# Altium project STLink_V2_Design.PrjPcb
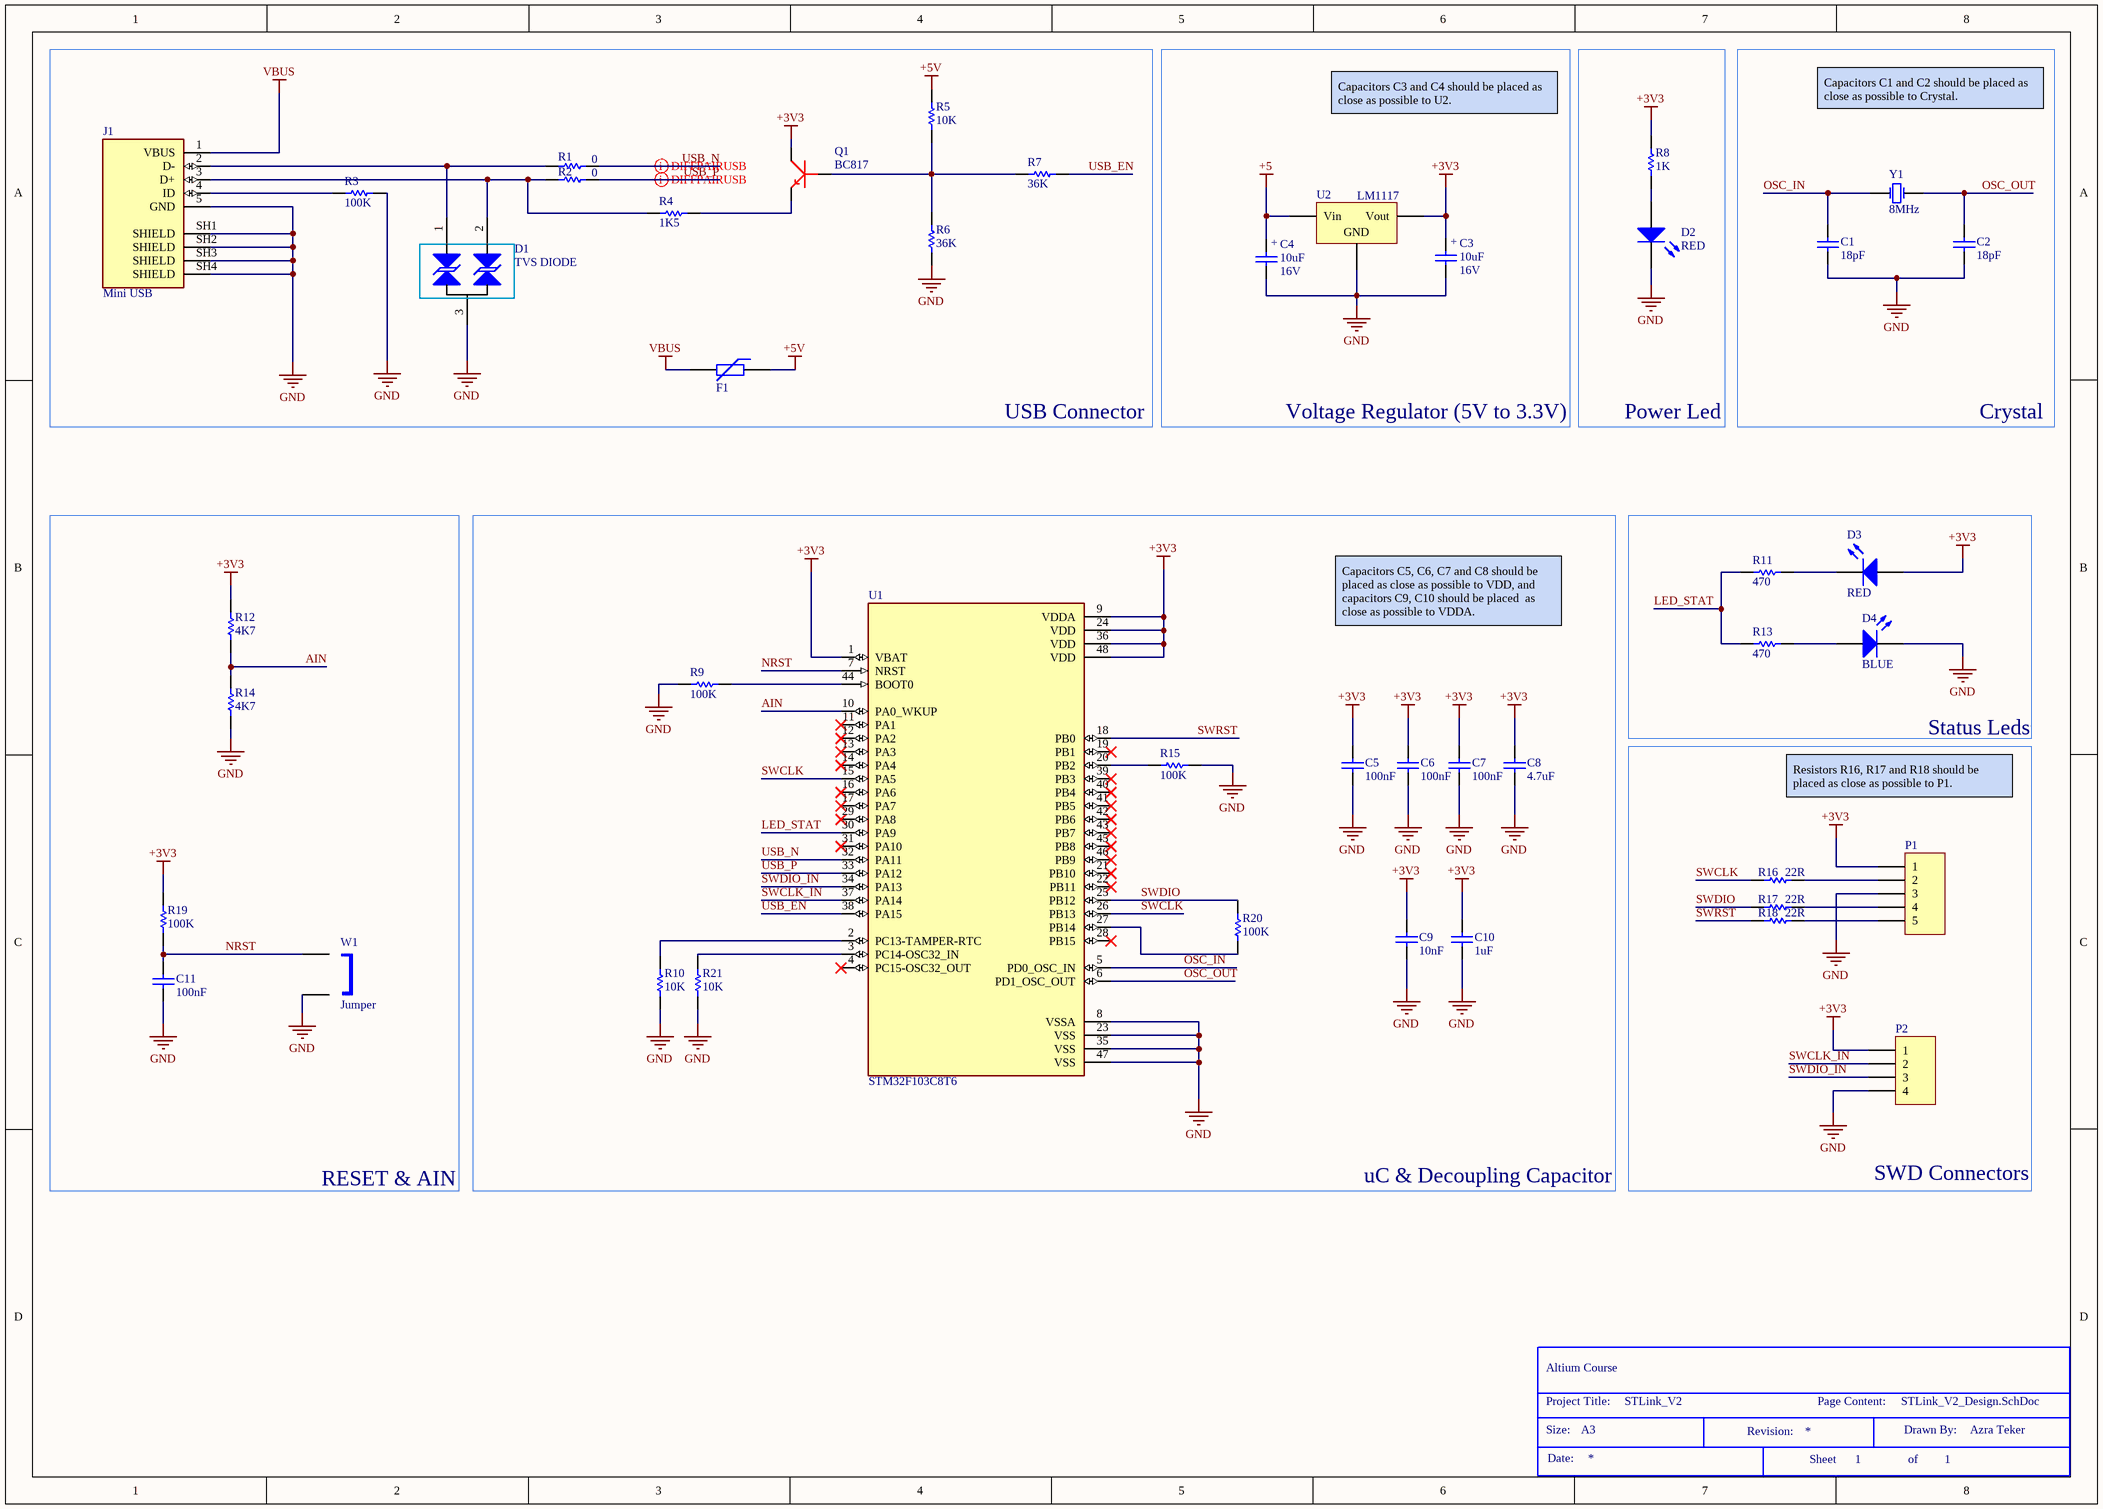
[diagram p0: STLink_V2_Design.SchDoc]
NameProject: STLink_V2
1 sheet, 46 parts. Net scope: global (net labels, ports and power ports of the same name join across sheets).
Board file: STLink_V2_Design.PcbDoc

## Sheet STLink_V2_Design.SchDoc
size A3; DocumentNumber: 1; SheetNumber: 1; SheetTotal: 1

### Parts
*?  Size: A3  Drawn By: Azra Teker  (hidden comment: Title Block)  (graphical)
C1  18pF  [C805]
C2  18pF  [C805]
C3  Volte: 16V  [MY_SMC_B]  (hidden comment: 10uF)
C4  Volte: 16V  [MY_SMC_B]  (hidden comment: 10uF)
C5  100nF  [C805]
C6  100nF  [C805]
C7  100nF  [C805]
C8  4.7uF  [C805]
C9  10nF  [C805]
C10  1uF  [C805]
C11  100nF  [C805]
D1  TVS DIODE  [SOT-23]
D2  RED  [MY_LED_1206]
D3  RED  [MY_LED_0805]
D4  BLUE  [MY_LED_0805]
F1  (no value)  [PTC-0805]
J1  Mini USB  [MiniUSB]
P1  Header 5  [My_1X05]  (value not drawn)
P2  Header 4  [My_1X04]  (value not drawn)
Q1  BC817  [SOT23_3]
R1  0  [R0603]
R2  0  [R0603]
R3  100K  [R0603]
R4  1K5  [R0603]
R5  10K  [R0603]
R6  36K  [R0603]
R7  36K  [R0603]
R8  1K  [R0603]
R9  100K  [R0603]
R10  10K  [R0603]
R11  470  [R0603]
R12  4K7  [R0603]
R13  470  [R0603]
R14  4K7  [R0603]
R15  100K  [R0603]
R16  22R  [R0603]
R17  22R  [R0603]
R18  22R  [R0603]
R19  100K  [R0603]
R20  100K  [R0603]
R21  10K  [R0603]
U1  STM32F103C8T6  [QFP50P900X900X160-48N]
U2  LM1117  [MY_SOT223]
W1  Jumper  [My_1X02]
Y1  8MHz  [XTAL-SMD]

### Blocks framed on the sheet
USB Connector: D1 F1 J1 Q1 R1-R7
Voltage Regulator (5V to 3.3V): C3 C4 U2
Power Led: D2 R8
Crystal: C1 C2 Y1
RESET & AIN: C11 R12 R14 R19 W1
uC & Decoupling Capacitor: C5-C10 R9 R10 R15 R20 R21 U1
Status Leds: D3 D4 R11 R13
SWD Connectors: P1 P2 R16-R18

### Nets
+3V3: C3.+ C5.2 C6.2 C7.2 C8.2 C9.2 C10.2 D3.A P1.1 P2.1 Q1.3(C) R8.1 R12.2 R19.2 U1.1(VBAT) U1.9(VDDA) U1.24(VDD) U1.36(VDD) U1.48(VDD) U2.2(Vout)
+5: C4.+ U2.3(Vin)
+5V: F1.1 R5.2
GND: C1.1 C2.1 C3.- C4.- C5.1 C6.1 C7.1 C8.1 C9.1 C10.1 C11.1 D1.3(A) D2.K D4.K J1.5(GND) J1.SH1(SHIELD) J1.SH2(SHIELD) J1.SH3(SHIELD) J1.SH4(SHIELD) P1.3 P2.4 R3.2 R6.1 R9.1 R10.1 R14.1 R15.1 R21.1 U1.8(VSSA) U1.23(VSS) U1.35(VSS) U1.47(VSS) U2.1(GND) W1.2
VBUS: F1.2 J1.1(VBUS)
AIN: R12.1 R14.2 U1.10(PA0_WKUP)
LED_STAT: R11.1 R13.1 U1.30(PA9)
NRST: C11.2 R19.1 U1.7(NRST) W1.1
OSC_IN: C1.2 U1.5(PD0_OSC_IN) Y1.1(OSC1)
OSC_OUT: C2.2 U1.6(PD1_OSC_OUT) Y1.2(OSC2)
SWCLK: R16.1 U1.15(PA5) U1.26(PB13)
SWCLK_IN: P2.2 U1.37(PA14)
SWDIO: R17.1 R20.2 U1.25(PB12)
SWDIO_IN: P2.3 U1.34(PA13)
SWRST: R18.1 U1.18(PB0)
USB_EN: R7.1 U1.38(PA15)
USB_N: R1.2 U1.32(PA11)
USB_P: R2.2 U1.33(PA12)
NetD1_1: D1.1(K) J1.2(D-) R1.1
NetD1_2: D1.2(K) J1.3(D+) R2.1 R4.1
NetD2_A: D2.A R8.2
NetD3_K: D3.K R11.2
NetD4_A: D4.A R13.2
NetJ1_4: J1.4(ID) R3.1
NetP1_2: P1.2 R16.2
NetP1_4: P1.4 R17.2
NetP1_5: P1.5 R18.2
NetQ1_1: Q1.1(B) R5.1 R6.2 R7.2
NetQ1_2: Q1.2(E) R4.2
NetR9_2: R9.2 U1.44(BOOT0)
NetR10_2: R10.2 U1.2(PC13-TAMPER-RTC)
NetR15_2: R15.2 U1.20(PB2)
NetR20_1: R20.1 U1.27(PB14)
NetR21_2: R21.2 U1.3(PC14-OSC32_IN)

Not connected (* = marked no-connect by the designer): U1 4(PC15-OSC32_OUT)* 11(PA1)* 12(PA2)* 13(PA3)* 14(PA4)* 16(PA6)* 17(PA7)* 19(PB1)* 21(PB10)* 22(PB11)* 28(PB15)* 29(PA8)* 31(PA10)* 39(PB3)* 40(PB4)* 41(PB5)* 42(PB6)* 43(PB7)* 45(PB8)* 46(PB9)*

### Layout directives
differential pair; differential pair class DiffPairUSB: USB_N, USB_P

### Notes on the sheet
- Capacitors C3 and C4 should be placed as close as possible to U2.
- Capacitors C1 and C2 should be placed as close as possible to Crystal.
- Capacitors C5, C6, C7 and C8 should be placed as close as possible to VDD, and capacitors C9, C10 should be placed  as close as possible to VDDA.
- Resistors R16, R17 and R18 should be placed as close as possible to P1.
- (in symbol Title Block) Altium Course; Project Title:; Page Content:; Size:; Revision:; Drawn By:; Date:; Sheet; of

### Library data of the parts
C1 C2 C5-C11 = Cap: Capacitor; Designer: Parsa Malekpour
  C1 C2: Value: 18pF
  C5-C7 C11: Value: 100nF
  C8: Value: 4.7uF
  C9: Value: 10nF
  C10: Value: 1uF
C3 C4 = Cap Pol: Polar capacitor; ASiD Part Number: C-AS; Value: 10uF
D1 = SM712
D2-D4 = LED: Typical INFRARED GaAs LED; ASiD Part Number: LED-AS
F1 = PTC: Published: 24-Mar-1999; PackageVersion: Mar-2003; PackageReference: 6-0805
J1 = Mini USB: MINI USB 2.0- B Type Receptacle conn. Right Angle Surface Mount Type; MF: Amphenol ICC; MP: 10033526-N3212LF; SnapEDA_Link: https://www.snapeda.com/parts/10033526-N3212LF/Amphenol+FCI/view-part/?ref=snap; Package: None; Value: *; Check_prices: https://www.snapeda.com/parts/10033526-N3212LF/Amphenol+FCI/view-part/?ref=eda
P1 = Header 5: Header, 5-Pin; ASiD Part Number: Header 5-AS
P2 = Header 4: Header, 4-Pin; ASiD Part Number: Header 4-AS
Q1 = bc817-16
R1-R21 = Resistor: Designer: Parsa Malekpour
  R1 R2: Value: 0
  R3 R9 R15 R19 R20: Value: 100K
  R4: Value: 1K5
  R5 R10 R21: Value: 10K
  R6 R7: Value: 36K
  R8: Value: 1K
  R11 R13: Value: 470
  R12 R14: Value: 4K7
  R16-R18: Value: 22R
U1 = STM32F103C8T6: ARM® Cortex®-M3 STM32F1 Microcontroller IC 32-Bit 72MHz 64KB (64K x 8) FLASH 48-LQFP (7x7); MF: STMicroelectronics; SnapEDA_Link: https://www.snapeda.com/parts/STM32F103C8T6/STMicroelectronics/view-part/?ref=snap; Package: LQFP-48 STMicroelectronics; Value: *; MP: STM32F103C8T6; Check_prices: https://www.snapeda.com/parts/STM32F103C8T6/STMicroelectronics/view-part/?ref=eda
U2 = LM1117: Low Drop Voltage Reg; ASiD Part Number: LM1117-AS
W1 = Jumper: Jumper Wire; ASiD Part Number: Jumper-AS
Y1 = XTAL: Crystal Oscillator; Designer: Parsa Malekpour; Email: Malekpour.parsa@Gmail.com; Value: 8MHz